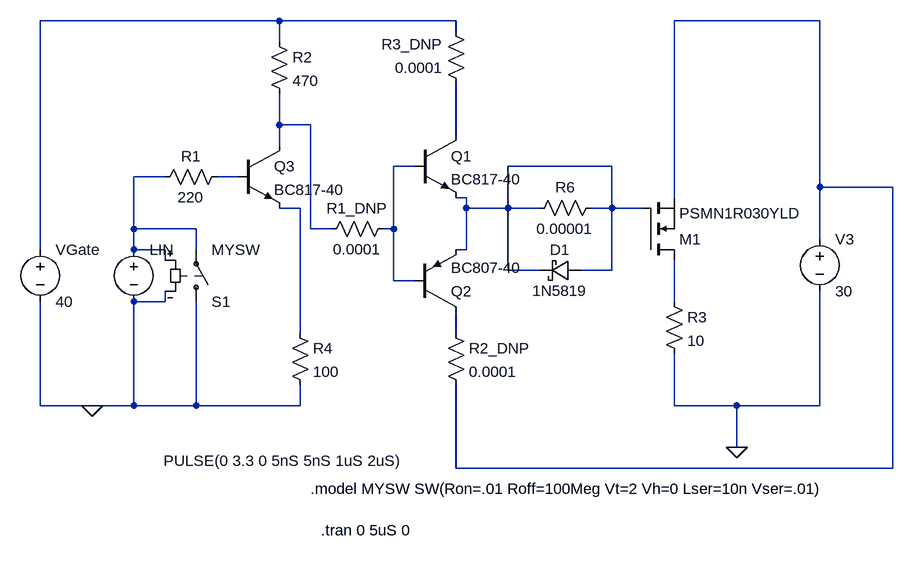
[diagram p0: schematic high_side_driver.asc]
high_side_driver.asc, the LTspice schematic file:
Version 4
SHEET 1 996 680
WIRE 48 -256 -320 -256
WIRE 320 -256 48 -256
WIRE 880 -256 656 -256
WIRE 320 -240 320 -256
WIRE 48 -224 48 -256
WIRE 48 -96 48 -144
WIRE 96 -96 48 -96
WIRE 320 -80 320 -160
WIRE 48 -64 48 -96
WIRE 256 -32 224 -32
WIRE 560 -32 400 -32
WIRE -128 -16 -176 -16
WIRE -16 -16 -48 -16
WIRE 880 0 880 -256
WIRE 992 0 880 0
WIRE 336 16 320 16
WIRE 656 16 656 -256
WIRE 80 32 48 32
WIRE 336 32 336 16
WIRE 400 32 400 -32
WIRE 400 32 336 32
WIRE 448 32 400 32
WIRE 560 32 560 -32
WIRE 560 32 528 32
WIRE 608 32 560 32
WIRE -176 64 -176 -16
WIRE -80 64 -176 64
WIRE 96 64 96 -96
WIRE 128 64 96 64
WIRE 224 64 224 -32
WIRE 224 64 208 64
WIRE 880 80 880 0
WIRE -320 96 -320 -256
WIRE -176 96 -176 64
WIRE -128 96 -176 96
WIRE -80 96 -80 64
WIRE 336 96 336 32
WIRE 336 96 320 96
WIRE -128 112 -128 96
WIRE 400 128 400 32
WIRE 448 128 400 128
WIRE 560 128 560 32
WIRE 560 128 512 128
WIRE 224 144 224 64
WIRE 256 144 224 144
WIRE -128 176 -128 160
WIRE -128 176 -176 176
WIRE 656 176 656 112
WIRE 80 224 80 32
WIRE 320 224 320 192
WIRE -320 336 -320 176
WIRE -240 336 -320 336
WIRE -176 336 -176 176
WIRE -176 336 -240 336
WIRE -80 336 -80 176
WIRE -80 336 -176 336
WIRE 80 336 80 304
WIRE 80 336 -80 336
WIRE 656 336 656 256
WIRE 752 336 656 336
WIRE 880 336 880 160
WIRE 880 336 752 336
WIRE 752 400 752 336
WIRE 320 432 320 304
WIRE 992 432 992 0
WIRE 992 432 320 432
FLAG 752 400 0
FLAG -240 336 0
SYMBOL npn 256 -80 R0
SYMATTR InstName Q1
SYMATTR Value BC817-40
SYMBOL pnp 256 192 M180
SYMATTR InstName Q2
SYMATTR Value BC807-40
SYMBOL voltage -320 80 R0
WINDOW 123 0 0 Left 2
WINDOW 39 0 0 Left 2
SYMATTR InstName VGate
SYMATTR Value 40
SYMBOL voltage -176 80 R0
WINDOW 3 46 341 Left 2
WINDOW 123 0 0 Left 2
WINDOW 39 0 0 Left 2
SYMATTR Value PULSE(0 3.3 0 5nS 5nS 1uS 2uS)
SYMATTR InstName LIN
SYMBOL sw -80 192 M180
SYMATTR InstName S1
SYMATTR Value MYSW
SYMBOL res 336 -144 R180
WINDOW 0 36 76 Left 2
WINDOW 3 36 40 Left 2
SYMATTR InstName R3_DNP
SYMATTR Value 0.0001
SYMBOL npn -16 -64 R0
SYMATTR InstName Q3
SYMATTR Value BC817-40
SYMBOL res 112 80 R270
WINDOW 0 32 56 VTop 2
WINDOW 3 0 56 VBottom 2
SYMATTR InstName R1_DNP
SYMATTR Value 0.0001
SYMBOL res 304 208 R0
SYMATTR InstName R2_DNP
SYMATTR Value 0.0001
SYMBOL res 544 16 R90
WINDOW 0 0 56 VBottom 2
WINDOW 3 32 56 VTop 2
SYMATTR InstName R6
SYMATTR Value 0.00001
SYMBOL schottky 512 112 R90
WINDOW 0 0 32 VBottom 2
WINDOW 3 32 32 VTop 2
SYMATTR InstName D1
SYMATTR Value 1N5819
SYMATTR Description Diode
SYMATTR Type diode
SYMBOL nmos 608 112 M180
SYMATTR InstName M1
SYMATTR Value PSMN1R030YLD
SYMBOL voltage 880 64 R0
WINDOW 123 0 0 Left 2
WINDOW 39 0 0 Left 2
SYMATTR InstName V3
SYMATTR Value 30
SYMBOL res -32 -32 R90
WINDOW 0 0 56 VBottom 2
WINDOW 3 32 56 VTop 2
SYMATTR InstName R1
SYMATTR Value 220
SYMBOL res 32 -240 R0
SYMATTR InstName R2
SYMATTR Value 470
SYMBOL res 64 208 R0
SYMATTR InstName R4
SYMATTR Value 100
SYMBOL res 640 160 R0
SYMATTR InstName R3
SYMATTR Value 10
TEXT 112 528 Left 2 !.tran 0 5uS 0
TEXT 96 464 Left 2 !.model MYSW SW(Ron=.01 Roff=100Meg Vt=2 Vh=0 Lser=10n Vser=.01)

The netlist it stands for:
* high_side_driver.asc
Q1 N004 N005 N006 0 BC817-40
Q2 N011 N005 N006 0 BC807-40
VGate N001 0 40
V§LIN N007 0 PULSE(0 3.3 0 5nS 5nS 1uS 2uS)
S1 0 N007 N007 0 MYSW
R3_DNP N004 N001 0.0001
Q3 N003 N008 N009 0 BC817-40
R1_DNP N003 N005 0.0001
R2_DNP N011 N002 0.0001
R6 N006 N006 0.00001
D1 N006 N006 1N5819
M1 N010 N006 N002 N002 PSMN1R030YLD
V3 N002 0 30
R1 N008 N007 220
R2 N001 N003 470
R4 N009 0 100
R3 N010 0 10
.model D D
.lib standard.dio
.model NPN NPN
.model PNP PNP
.lib standard.bjt
.model NMOS NMOS
.model PMOS PMOS
.lib standard.mos
.tran 0 5uS 0
.model MYSW SW(Ron=.01 Roff=100Meg Vt=2 Vh=0 Lser=10n Vser=.01)
.backanno
.end